# EAGLE design Nixie_Pin_Out_Board_v1.0.1 (EAGLE 6.5.0)
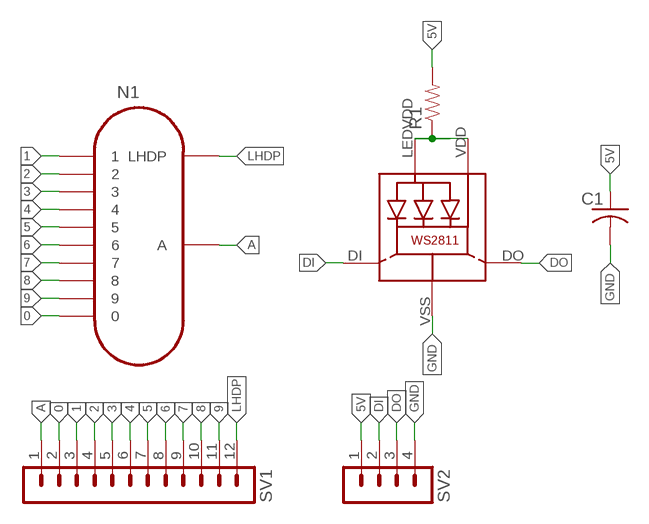
[diagram p0: schematic, sheet 1]

## Parts
C1  C-USC0805K  [C0805K]
LED1  WS28115050  [WS28115050]
N1  IN-12B  [IN-12]
R1  RESISTOR0805-RES  [0805]
SV1  MA12-1  [MA12-1]
SV2  MA04-1  [MA04-1]

## Nets
0: N1.0 SV1.2
1: N1.1 SV1.3
2: N1.2 SV1.4
3: N1.3 SV1.5
4: N1.4 SV1.6
5: N1.5 SV1.7
5V: C1.1 R1.2 SV2.1
6: N1.6 SV1.8
7: N1.7 SV1.9
8: N1.8 SV1.10
9: N1.9 SV1.11
A: N1.A SV1.1
DI: LED1.DI SV2.2
DO: LED1.DO SV2.3
GND: C1.2 LED1.VSS(GND) SV2.4
LHDP: N1.LHDP SV1.12
WIRE1: LED1.LEDVDD LED1.VDD R1.1

## Library data of the parts
C1 = rcl:C-US: CAPACITOR, American symbol
LED1 = microbuilder:WS28115050
N1 = russian-nixies:IN-12B: IN-12B: medium numeric topview nixie tube
R1 = SparkFun-Passives:RESISTOR: Resistor Basic schematic elements and footprints for 0603, 1206, and PTH resistors.
SV1 = con-lstb:MA12-1: PIN HEADER; OC_FARNELL: unknown; OC_NEWARK: unknown
SV2 = con-lstb:MA04-1: PIN HEADER; OC_FARNELL: unknown; OC_NEWARK: unknown

## Board
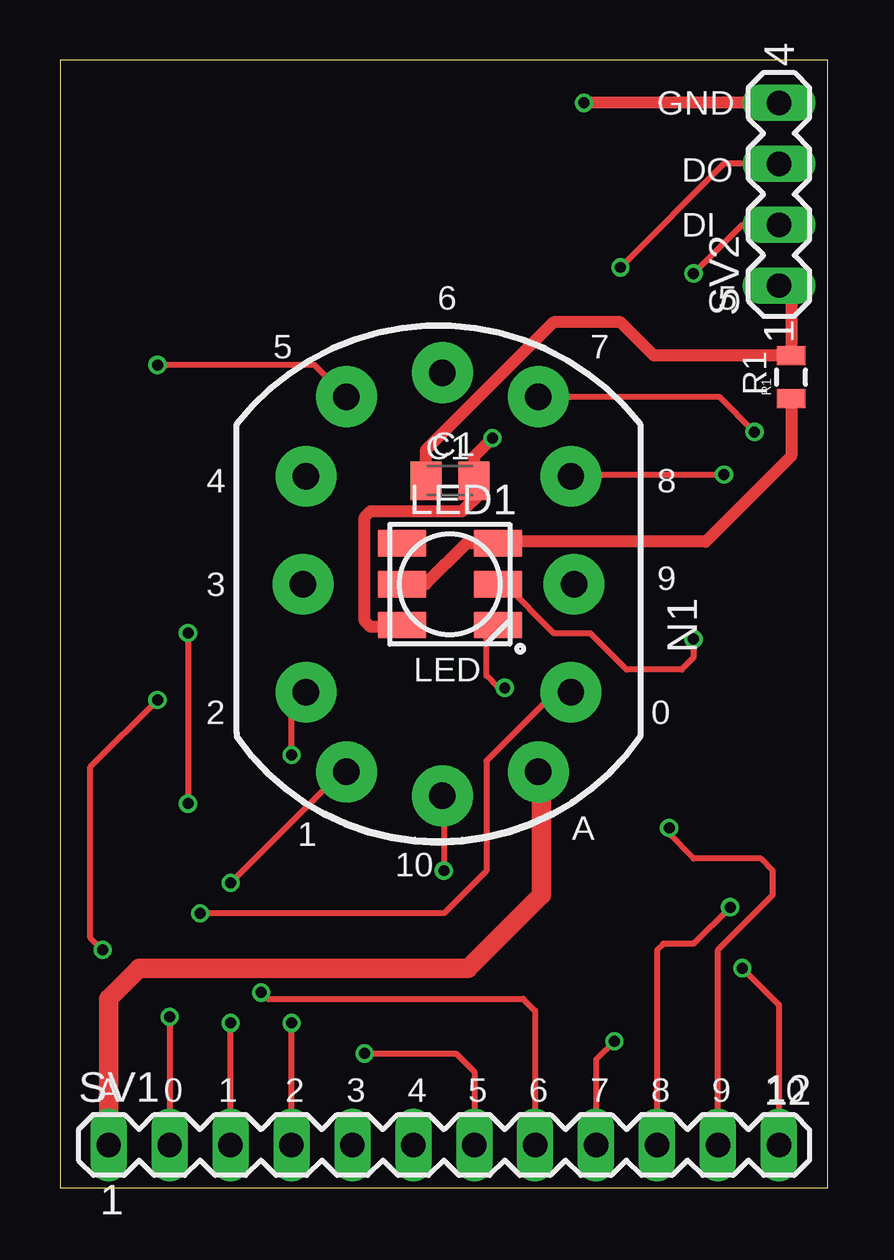
[diagram p1: board, top side]
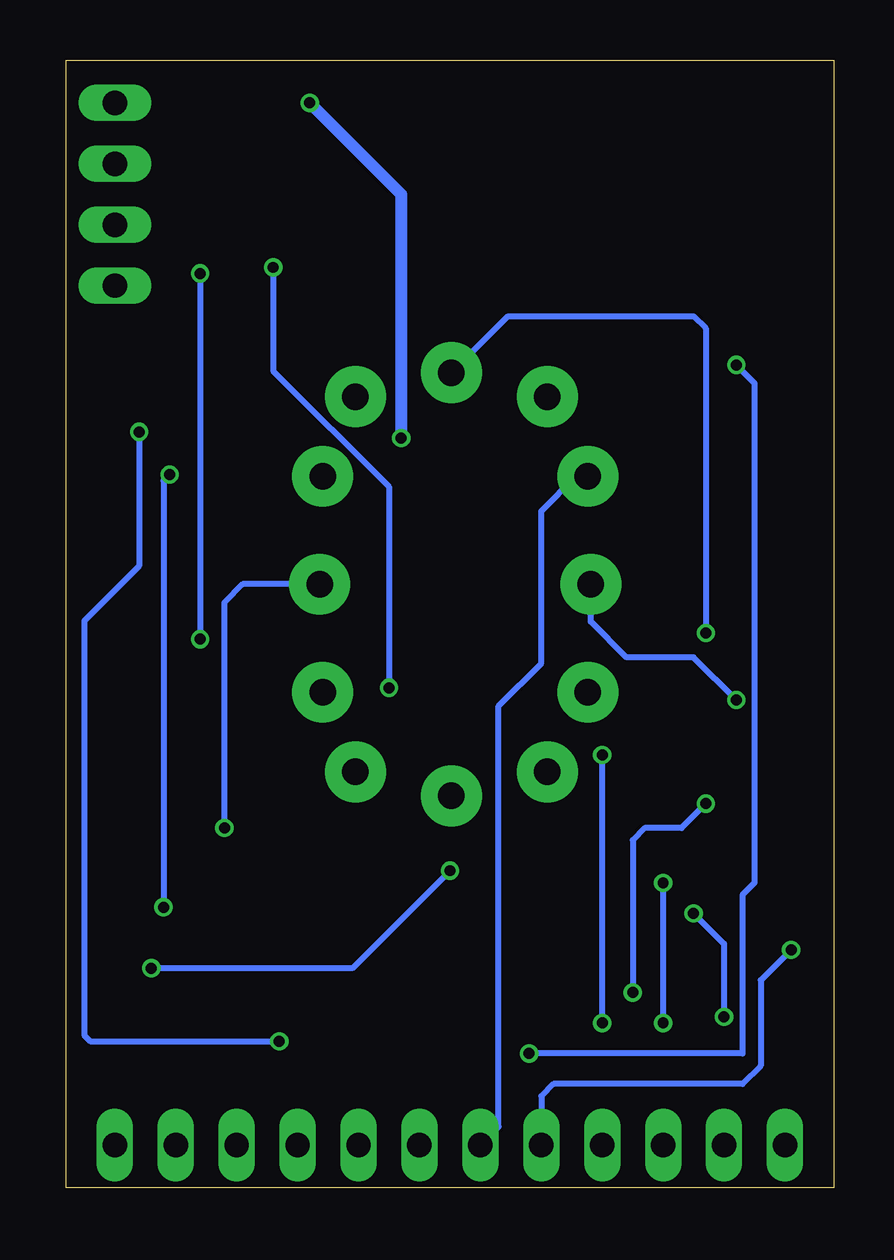
[diagram p2: board, bottom side, seen from below]

Size 32 x 47 mm. Coordinates in mm from the lower left corner, seen from the top.
Outline: 0,0 32,0 32,47 0,47 0,0
Copper layers (1*16): Top 0.035mm / dielectric 1.5mm / Bottom 0.035mm
Design rules "SeeedStudio_2layer_DRU_no_angle_20140221": minimum track width 6mil, minimum drill 12mil, track to track 6mil, track to pad 6mil, pad to pad 6mil, via to via 6mil, smd to smd 0mil, copper to edge 10mil, drill to drill 10mil, minimum pad ring 10mil, minimum via ring 6mil, stop-mask expansion 2mil, vias tented up to drill 100mil, thermal gap 10mil

### Footprints (pad centres in the part's own frame; a part is rotated, then mirrored left to right if it is on the bottom)
C0805K = smd 1.3 x 1.6: 1 -1,0; 2 1,0
WS28115050 = smd 2 x 1.1: DI 2,0; DO 2,-1.7; LEDVDD -2,0; NC -2,1.7; VDD 2,1.7; VSS -2,-1.7
IN-12 = drill 1.1 pad 2.54: 0 5.048,-4.5; 1 -4.317,-7.817; 2 -6,-4.5; 3 -6.127,0; 4 -6,4.5; 5 -4.317,7.817; 6 -0.318,8.818; 7 3.683,7.817; 8 5.048,4.5; 9 5.175,0; A 3.683,-7.817; LHDP -0.318,-8.818
0805 = smd 0.8 x 1.2: 1 -0.9,0; 2 0.9,0
MA12-1 = drill 1.016 long: 1 -13.97,0; 2 -11.43,0; 3 -8.89,0; 4 -6.35,0; 5 -3.81,0; 6 -1.27,0; 7 1.27,0; 8 3.81,0; 9 6.35,0; 10 8.89,0; 11 11.43,0; 12 13.97,0
MA04-1 = drill 1.016 long: 1 -3.81,0; 2 -1.27,0; 3 1.27,0; 4 3.81,0

### Placement (x,y rotation side)
C1  16.26,29.46 0 top
LED1  16.26,25.15 0 top
N1  16.26,25.15 0 top
R1  30.48,33.78 90 top
SV1  16,1.78 0 top
SV2  29.97,41.4 90 top

### Tracks (layer width: path | path; a pad name or v marks a point on that pad's centre or on a via)
0  (via drill 0.46)
  Top 0.254: N1.0 20.65,20.65 17.78,17.78 17.78,13.21 16,11.43 v5.84,11.43 | v4.57,7.11 SV1.2
  Bottom 0.254: v5.84,11.43 4.57,10.16 v4.57,7.11
1  (via drill 0.46)
  Top 0.254: SV1.3 v7.11,6.86 | v7.11,12.7 11.74,17.33 N1.1
  Bottom 0.254: v7.11,6.86 v7.11,12.7
2  (via drill 0.46)
  Top 0.254: SV1.4 v9.65,6.86 | v9.65,18.03 9.65,20.04 N1.2
  Bottom 0.254: v9.65,6.86 9.65,17.78 v9.65,18.03
3  (via drill 0.46)
  Top 0.254: v1.78,9.91 1.27,10.41 1.27,17.53 v4.06,20.32
  Bottom 0.254: v1.78,9.91 3.05,8.64 3.05,5.08 3.81,4.32 11.68,4.32 12.19,3.81 SV1.5 | v4.06,20.32 5.84,22.1 8.64,22.1 10.13,23.59 N1.3
4
  Bottom 0.254: SV1.6 13.97,2.54 13.97,20.07 12.19,21.84 12.19,22.61 12.19,28.19 10.74,29.65 N1.4
5  (via drill 0.46)
  Top 0.254: N1.5 10.61,34.29 v4.06,34.29 | v12.7,5.59 16.51,5.59 17.27,4.83 SV1.7
  Bottom 0.254: v4.06,34.29 3.3,33.53 3.3,12.7 3.81,12.19 3.81,5.59 v12.7,5.59
5V
  Top 0.508: C1.1 15.24,29.48 15.24,30.73 15.75,31.24 20.57,36.07 23.37,36.07 24.75,34.68 R1.2 30.48,37.08 SV2.1
6  (via drill 0.46)
  Top 0.254: v5.33,23.11 v5.33,16 | v8.38,8.13 8.64,7.87 19.3,7.87 19.81,7.37 SV1.8
  Bottom 0.254: N1.6 13.58,36.32 5.84,36.32 5.33,35.81 v5.33,23.11 | v5.33,16 6.35,14.99 7.87,14.99 8.38,14.48 v8.38,8.13
7  (via drill 0.46)
  Top 0.254: N1.7 27.49,32.96 v28.96,31.5 | SV1.9 22.35,5.08 22.35,5.33 v23.11,6.1
  Bottom 0.254: v28.96,31.5 28.96,25.91 31.24,23.62 31.24,6.35 30.99,6.1 v23.11,6.1
8  (via drill 0.46)
  Top 0.254: N1.8 21.38,29.72 v27.69,29.72 | v27.94,11.68 26.42,10.16 25.15,10.16 24.89,9.91 SV1.10
  Bottom 0.254: v27.69,29.72 27.94,29.46 v27.94,11.68
9  (via drill 0.46)
  Top 0.254: SV1.11 27.43,9.91 29.72,12.19 29.72,13.21 29.21,13.72 26.42,13.72 25.4,14.73 v25.4,14.99
  Bottom 0.254: N1.9 24.64,25.15 25.4,24.38 v25.4,14.99
A
  Top 0.813: SV1.1 2.03,7.87 3.3,9.14 17.02,9.14 20.07,12.19 20.07,17.2 N1.A
DI  (via drill 0.46)
  Top 0.254: SV2.2 28.45,40.13 v26.42,38.1 | v26.42,22.86 26.42,22.1 25.91,21.59 23.62,21.59 22.35,22.86 22.1,23.11 20.57,23.11 18.54,25.15 LED1.DI
  Bottom 0.254: v26.42,38.1 v26.42,22.86
DO  (via drill 0.46)
  Top 0.254: SV2.3 27.69,42.67 v23.37,38.35 | v18.54,20.83 18.29,20.83 17.78,21.34 17.78,22.97 LED1.DO
  Bottom 0.254: v23.37,38.35 23.37,34.04 18.54,29.21 v18.54,20.83
GND  (via drill 0.46)
  Top 0.152: 17.78,29.21 C1.2
  Top 0.508: SV2.4 v21.84,45.21 | v18.03,31.24 17.26,30.46 C1.2 17.26,29.23 17.53,28.96 16.76,28.19 12.95,28.19 12.7,27.94 12.7,23.62 12.95,23.37 14.18,23.37 LED1.VSS
  Bottom 0.508: v21.84,45.21 18.03,41.4 v18.03,31.24
LHDP  (via drill 0.46)
  Top 0.254: N1.LHDP 16,16.27 v16,13.21 | v28.45,9.14 29.97,7.62 SV1.12
  Bottom 0.254: v16,13.21 20.07,9.14 v28.45,9.14
WIRE1
  Top 0.508: R1.1 30.48,30.48 26.92,26.92 18.33,26.92 LED1.VDD 16.94,26.85 15.24,25.15 LED1.LEDVDD

### Text on the board
_tplace: GND | DO | DI | 6 | 5 | 5 | 7 | R1 | C1 | 4 | 8 | 3 | 9 | LED | 2 | 0 | 1 | A | 10 | A | 0 | 1 | 2 | 3 | 4 | 5 | 6 | 7 | 8 | 9 | 10